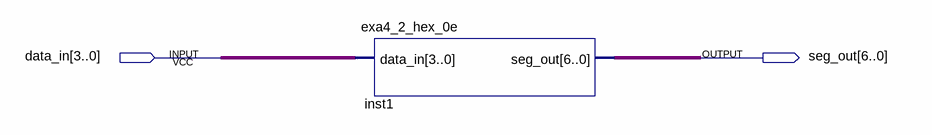
[diagram p0: schematic sheet]
// Quartus schematic experiment_four_task2.bdf as structural Verilog: 1 symbols, 2 pins
module experiment_four_task2 (
  input  [3:0] data_in,
  output [6:0] seg_out
);

  exa4_2_hex_0e inst1 (.data_in(data_in), .seg_out(seg_out));
endmodule
